# Altium project Theremin_Project.PrjPcb
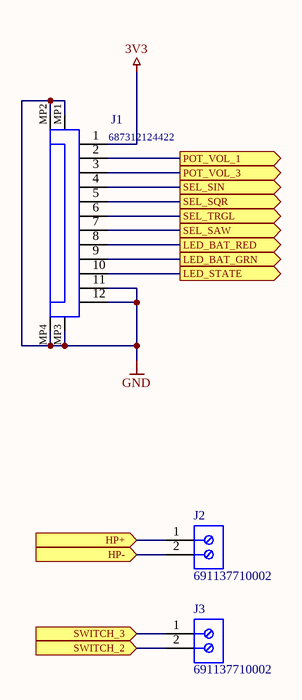
[diagram p0: Interfaces.SchDoc]
3 sheets, 55 parts. Net scope: flat (ports and power ports of the same name join across sheets).
Board file: Theremin_Chafla-Jonathan.PcbDoc
Sheets:
  Interfaces.SchDoc
  Power_Supply.SchDoc
  Central_Unit.SchDoc

## Sheet Interfaces.SchDoc
size A3; Author: M.Ricchieri; Organization: ETML-ES; Address1: Avenue Recordon 1; Address2: 1004 Lausanne; Address3: Switzerland; SheetNumber: 2; SheetTotal: 6

### Parts
J1  687312124422  [687312124422]
J2  691137710002  [691137710002]
J3  691137710002  [691137710002]

### Ports
HP+ (in), HP- (in), LED_BAT_GRN (out), LED_BAT_RED (out), LED_STATE (out), POT_VOL_1 (out), POT_VOL_3 (out), SEL_SAW (out), SEL_SIN (out), SEL_SQR (out), SEL_TRGL (out), SWITCH_2 (in), SWITCH_3 (in)

### Nets
3V3: J1.1
GND: J1.11 J1.12 J1.MP1 J1.MP2 J1.MP3 J1.MP4
RD7: J1.10 ; port LED_STATE
RE0: J1.9 ; port LED_BAT_GRN
RE1: J1.8 ; port LED_BAT_RED
Sel-Sinus: J1.4 ; port SEL_SIN
Sel-Square: J1.5 ; port SEL_SQR
Sel_Sawtooth: J1.7 ; port SEL_SAW
Sel_Triangle: J1.6 ; port SEL_TRGL
NetC21_2: J3.2 ; port SWITCH_2
NetJ1_2: J1.2 ; port POT_VOL_1
NetJ1_3: J1.3 ; port POT_VOL_3
NetJ2_1: J2.1 ; port HP+
NetJ2_2: J2.2 ; port HP-
NetJ3_1: J3.1 ; port SWITCH_3

### Notes on the sheet
- Fichier :
- a
- Date :
- Heure :
- Version :
- Auteur :
- Modif.
- b
- c
- d
- Projet :
- No :
- Nb feuilles
- Feuille n°
- Chemin :

### Library data of the parts
J1 = CMP-1502-01609-1: SMT ZIF Connectors WR-FPC, Vertical, Type A, pitch 0.5 mm, 12 pins; Manufacturer: Wurth Elektronik; Rated Current: 0.5A; Contact Design: TypeA; Withstanding Voltage: 250VAC; Contact Resistance: 20mOhm; Working Voltage: 50VAC; Pitch: 0.5mm; Pin Number: 12; Datasheet URL: https://katalog.we-online.de/em/datasheet/687312124422.pdf; Manufacturer URL: http://www.we-online.de; Publisher: WurthElektronik; Part Number: 687312124422; Operating Temperature: -25to85degC; Orientation: Vertical; Package Reference: 687312124422; Packaging: TapeandReel; Mounting Technology: SMT
J2 J3 = CMP-1502-03324-1: Series 1377 - 5.00 mm Horizontal Entry with Pressure Clamp WR-TBL, 2 pin; Manufacturer: Wurth Elektronik; Pin Number: 2; Pitch: 5.00mm; Operating Temperature: -30to120degC; Package Reference: 691137710002; Publisher: WurthElektronik; Mounting Technology: THT; Manufacturer URL: http://www.we-online.de; Packaging: Box; Part Number: 691137710002; Datasheet URL: http://katalog.we-online.de/pbs/datasheet/691137710002.pdf

## Sheet Power_Supply.SchDoc
size A3; Author: Adriano et Luis; Organization: ETML-ES; Address1: Avenue Recordon 1; Address2: 1004 Lausanne; Address3: Switzerland; Revision: 1; SheetNumber: 3; SheetTotal: 6
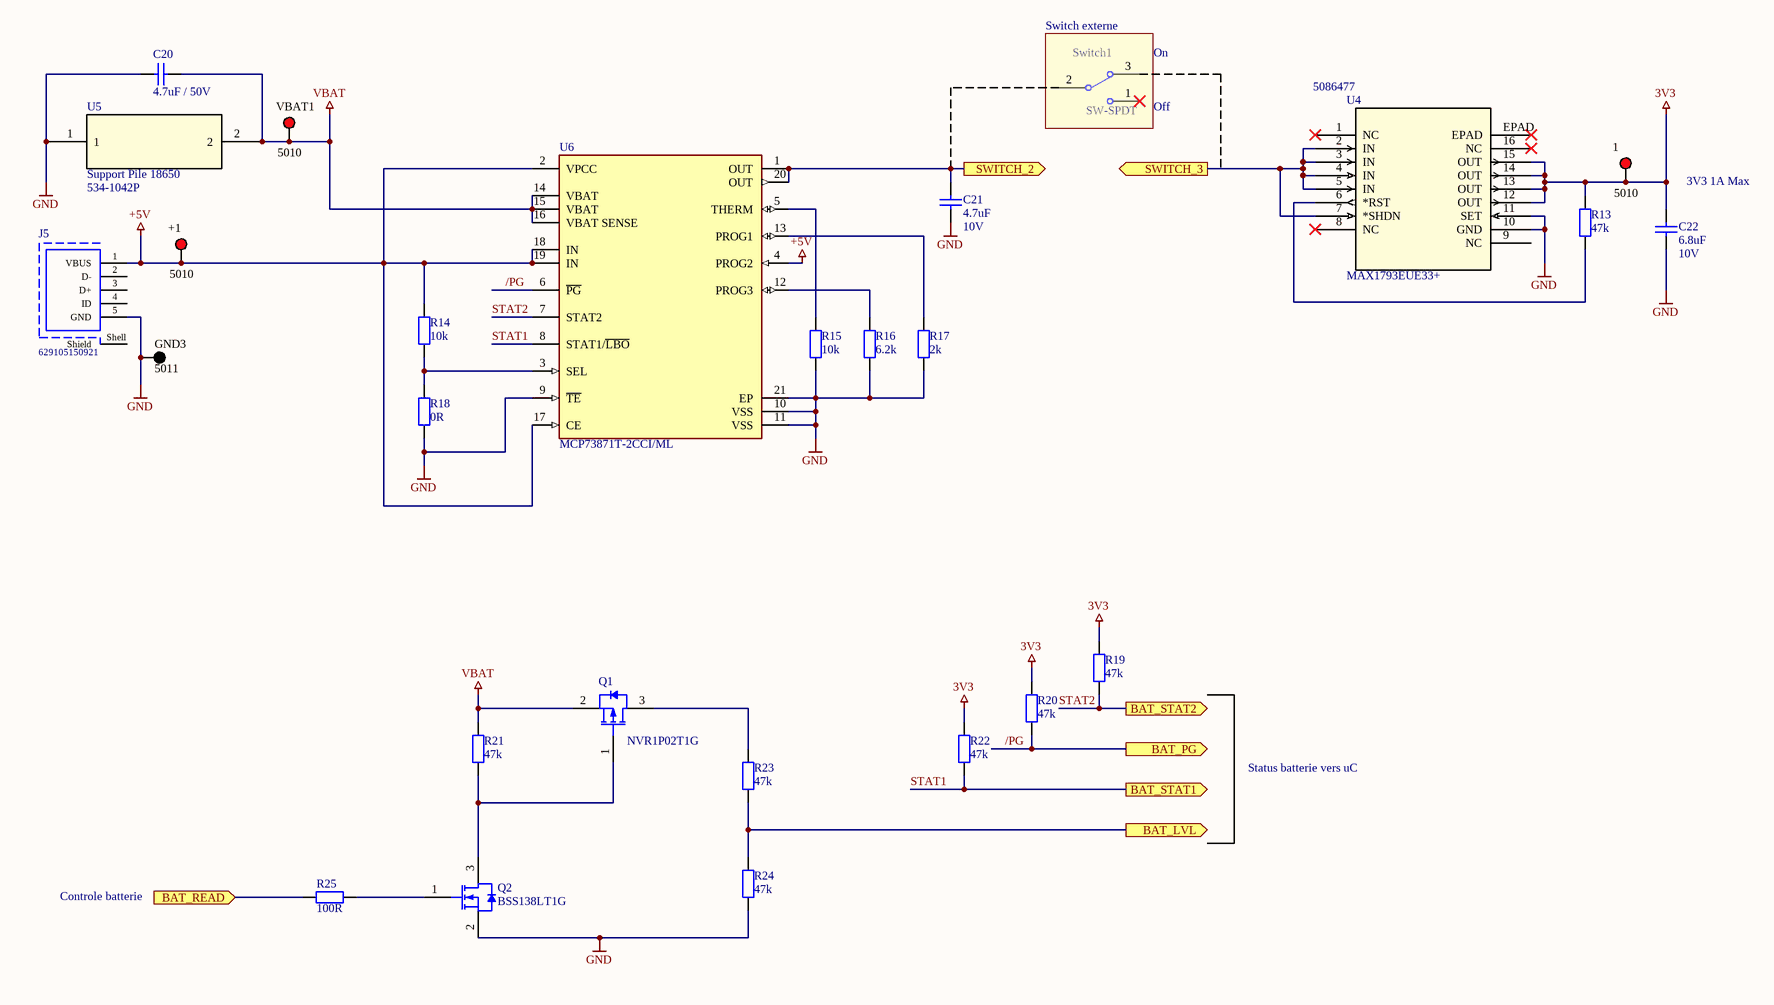
[diagram p1: Power_Supply.SchDoc]

### Parts
1  5010  [KSTN-5010_V]
+1  5010  [KSTN-5010_V]
C20  4.7uF / 50V  [CAPC0805]
C21  value 4.7uF  Tension: 10V  [CAPC0805]  (hidden comment: Cap)
C22  value 6.8uF  Tension: 10V  [CAPC0805]  (hidden comment: Cap)
GND3  5011  [KSTN-5011_V]
J5  629105150921  [629105150921]
Q1  NVR1P02T1G  [ONSC-SOT-23-3-318-08_V]
Q2  BSS138LT1G  [ONSC-SOT-23-3-318-08_V]
R13  value 47k  [RESC0805]  (hidden comment: VALUE)
R14  value 10k  [RESC0805]  (hidden comment: VALUE)
R15  value 10k  [RESC0805]  (hidden comment: VALUE)
R16  value 6.2k  [RESC0805]  (hidden comment: VALUE)
R17  value 2k  [RESC0805]  (hidden comment: VALUE)
R18  value 0R  [RESC0805]  (hidden comment: VALUE)
R19  value 47k  [RESC0805]  (hidden comment: VALUE)
R20  value 47k  [RESC0805]  (hidden comment: VALUE)
R21  value 47k  [RESC0805]  (hidden comment: VALUE)
R22  value 47k  [RESC0805]  (hidden comment: VALUE)
R23  value 47k  [RESC0805]  (hidden comment: VALUE)
R24  value 47k  [RESC0805]  (hidden comment: VALUE)
R25  value 100R  [RESC0805]  (hidden comment: VALUE)
Switch1  SW-SPDT  [TL36WW15050]  (graphical)
U4  MAX1793EUE33+  Supplier Part Number 1: 5086477  [21-0108_U16E+3_MXM]
U5  Support Pile 18650  Supplier Part Number 1: 534-1042P  [FP-1042P-MFG]
U6  MCP73871T-2CCI/ML  [FP-C04-126-IPC_C]
VBAT1  5010  [KSTN-5010_V]

### Blocks framed on the sheet
Switch externe: Switch1

### Ports
BAT_LVL (out), BAT_PG (out), BAT_READ (in), BAT_STAT1 (out), BAT_STAT2 (out), SWITCH_2 (out), SWITCH_3 (out)

### Nets
3V3: 1.1 C22.2 R13.2 R19.2 R20.2 R22.2 U4.12(OUT) U4.13(OUT) U4.14(OUT) U4.15(OUT)
+5V: +1.1 J5.1(VBUS) R14.2 U6.2(VPCC) U6.4(PROG2) U6.17(CE) U6.18(IN) U6.19(IN)
GND: C20.1 C21.1 C22.1 GND3.1 J5.5(GND) Q2.2(S) R15.1 R16.1 R17.1 R18.1 R24.1 U4.10(GND) U4.11(SET) U5.1 U6.9(~{TE}) U6.10(VSS) U6.11(VSS) U6.21(EP)
VBAT: C20.2 Q1.2(S) R21.1 U5.2 U6.14(VBAT) U6.15(VBAT) U6.16(VBAT_SENSE) VBAT1.1
/PG: R20.1 U6.6(~{PG}) ; port BAT_PG
ADC-Battery: R23.1 R24.2 ; port BAT_LVL
RC6: R25.1 ; port BAT_READ
STAT1: R22.1 U6.8(STAT1/~{LBO}) ; port BAT_STAT1  [project net RD6]
STAT2: R19.1 U6.7(STAT2) ; port BAT_STAT2  [project net RD5]
NetC21_2: C21.2 U6.1(OUT) U6.20(OUT) ; port SWITCH_2
NetJ3_1: U4.2(IN) U4.3(IN) U4.4(IN) U4.5(IN) U4.7(*SHDN) ; port SWITCH_3
NetQ1_1: Q1.1(G) Q2.3(D) R21.2
NetQ1_3: Q1.3(D) R23.2
NetQ2_1: Q2.1(G) R25.2
NetR13_1: R13.1 U4.6(*RST)
NetR14_1: R14.1 R18.2 U6.3(SEL)
NetR15_2: R15.2 U6.5(THERM)
NetR16_2: R16.2 U6.12(PROG3)
NetR17_2: R17.2 U6.13(PROG1)

Not connected (* = marked no-connect by the designer): J5 2(D-) 3(D+) 4(ID) Shell(Shield); Switch1 1* 2 3; U4 1(NC)* 8(NC)* 9(NC) 16(NC)* EPAD*

### Notes on the sheet
- (near Switch1) Off
- (near Switch1) On
- 3V3 1A Max
- Status batterie vers uC
- Controle batterie
- Fichier :
- a
- Date :
- Heure :
- Version :
- Auteur :
- Modif.
- b
- c
- d
- Projet :
- No :
- Nb feuilles
- Feuille n°
- Chemin :

### Library data of the parts
1 +1 VBAT1 = CMP-1672-00002-4: Test Point, Red, Through Hole, RoHS, Bulk; Manufacturer: Keystone; Contact Material: Bronze; Mounting Technology: Through Hole; RoHSCompliant: true; Pins: 1; Package Quantity: 100; ComponentLink2Description: Datasheet; Height: 8.12 mm; ComponentLink1URL: http://www.keyelco.com/; DatasheetVersion: Rev. F, 12/2013; Mount: Through Hole; PackageReference: 5010; Contact Plating: Silver; Packaging: Bulk; Colour: Red; REACH SVHC: No SVHC; PackageDescription: 1-Pin Through Hole Device, Dia 3.17 mm; ComponentLink2URL: http://www.keyelco.com/product-pdf.cfm?p=1319; ComponentLink1Description: Manufacturer URL
C20-C22 = Cap: Capacitor; Published: 8-Jun-2000; LatestRevisionDate: 17-Jul-2002; LatestRevisionNote: Re-released for DXP Platform.; PackageReference: RAD-0.3; Publisher: Altium Limited; PackageDescription: Radial Cap, Thru-Hole; 2 Leads; 0.3 in Pin Spacing
GND3 = CMP-1672-00003-4: Test Point, Black, Through Hole, RoHS, Bulk; Manufacturer: Keystone; ComponentLink2URL: http://www.keyelco.com/product-pdf.cfm?p=1320; Colour: Black; Pins: 1; REACH SVHC: No SVHC; ComponentLink1URL: http://www.keyelco.com/; PackageReference: 5011; Contact Plating: Silver; Package Quantity: 100; Packaging: Bulk; RoHSCompliant: true; Height: 8.12 mm; PackageDescription: 1-Pin Through Hole Device, Dia 3.17 mm; Mount: Through Hole; Mounting Technology: Through Hole; DatasheetVersion: Rev. F, 12/2013; ComponentLink1Description: Manufacturer URL; Contact Material: Bronze; ComponentLink2Description: Datasheet
J5 = CMP-1502-03249-1: Micro USB 2.0 Type AB Receptacle WR-COM, Horizontal, SMT; Manufacturer: Wurth Elektronik; Rated Current: 1.8A; Contact Resistance: 30mOhm; Working Voltage: 30VAC; Publisher: WurthElektronik; Part Number: 629105150921; Operating Temperature: -40to85degC; Gender: Receptacle; Packaging: TapeandReel; Connector Type: MicroUSB2.0TypeAB; Datasheet URL: https://katalog.we-online.de/em/datasheet/629105150921.pdf; Mounting Technology: SMT; Orientation: Horizontal; Package Reference: 629105150921; Manufacturer URL: http://www.we-online.de
Q1 = CMP-1058-00745-1: Power MOSFET, -20 V, -1 A, P-Channel, 3-Pin SOT-23, Pb-Free, Tape and Reel; Manufacturer: On Semiconductor; Ciss Typ (pF): 165; Configuration: Single; VGS(th) Max (V): 2.3; Channel Polarity: P Channel; V(BR)DSS Min (V): 20; ID Max (A): 1; Coss Typ (pF): 110; Qrr Typ (nC): 8; Crss Typ (pF): 35; PD Max (W): 0.4; DatasheetVersion: Rev. 7; ComponentLink1Description: Manufacturer URL; PackageReference: SOT-23-3-318-08; ComponentLink2Description: Datasheet; ComponentLink2URL: http://www.onsemi.cn/pub_link/Collateral/NTR1P02T1-D.PDF; Packing: Tape and Reel; Package Type: SOT-23-3; ComponentLink1URL: http://www.onsemi.com/; RoHS: Pb-Free; PartNumber: NVR1P02T1G; PackageVersion: Rev. AP, 11/2009; PackageDescription: 3-Pin Small Outline Transistor, Body 2.92 x 1.3 mm, Pitch 0.95 mm; ComponentLink3URL: http://www.onsemi.cn/pub_link/Collateral/318-08.PDF; ComponentLink3Description: Package Specification; VGS Max (V): 20; Mounting Technology: Surface Mount
Q2 = CMP-1058-00767-1: Power MOSFET, 200 mA, 50 V, N-Channel, 3-Pin SOT-23, Pb-Free, Tape and Reel; Manufacturer: On Semiconductor; PD Max (W): 0.225; Coss Typ (pF): 12; V(BR)DSS Min (V): 50; VGS Max (V): 20; Channel Polarity: N Channel; Configuration: Single; VGS(th) Max (V): 1.5; Ciss Typ (pF): 40; Crss Typ (pF): 3.5; ID Max (A): 0.2; ComponentLink3Description: Package Specification; PackageDescription: 3-Pin Small Outline Transistor, Body 2.92 x 1.3 mm, Pitch 0.95 mm; PackageReference: SOT-23-3-318-08; RoHS: Pb-Free; Mounting Technology: Surface Mount; ComponentLink1Description: Manufacturer URL; ComponentLink2URL: http://www.onsemi.com/pub_link/Collateral/BSS138LT1-D.PDF; ComponentLink2Description: Datasheet; Packing: Tape and Reel; PackageVersion: Rev. AP, 11/2009; PartNumber: BSS138LT1G; Package Type: SOT-23-3; ComponentLink1URL: http://www.onsemi.com/; DatasheetVersion: Rev. 8; ComponentLink3URL: http://www.onsemi.cn/pub_link/Collateral/318-08.PDF
R13-R25 = RES: Resistor
Switch1 = SW-SPDT: SPDT Subminiature Toggle Switch, Right Angle Mounting, Vertical Actuation; Published: 24-Mar-1999; LatestRevisionDate: 17-Dec-2003; LatestRevisionNote: Schematic revised, PCB Footprint replaced.; DatasheetVersion: 05-Dec-2000; PackageReference: TL36WW15050; Publisher: Altium Limited; PackageDescription: Switch; 4 Leads; ComponentLink1Description: Manufacturer Link; ComponentLink1URL: http://www.apem.com
U4 = MAX1793EUE33+: Fixed/Adjustable Positive LDO Regulator, 1.25V Min, 5V Max, 0.35V Dropout, PMOS, PDSO16; Mfr_Name: Maxim Integrated Products; Manufacturer 1: Maxim; Package Body Material: Plastic; Regulator Type: FIXED/ADJUSTABLE POSITIVE SINGLE OUTPUT LDO REGULATOR; Dropout Voltage1-Max: 350mV; Dropout Voltage1-Nom: 210mV; Input Voltage Absolute-Max: 6V; Line Regulation-Max: 0.0104%; Line Regulation-Max (%/V): 0.015; Number of Functions: 1; Output Current1-Max: 1A; Output Voltage1-Nom: 3.3V; Package Equivalence Code: TSSOP16,.25; Time @ Peak Reflow Temperature-Max (s): 30s; Voltage Tolerance-Max: 3%; Qualification Status: Not Qualified; Copyright: Copyright (C) 2021 Ultra Librarian. All rights reserved.; Manufacturer_Part_Number: MAX1793EUE33+; Digi-Key_Part_Number_1: MAX1793EUE33+-ND; RefDes: RefDes; Type: DEV; Supplier 1: Future Electronics; Manufacturer Part Number 1: MAX1793EUE33+; RoHS: Yes; Category: Voltage Regulators - Linear; Stock 1: 11; Pricing 1: 1=2,68000, 20=2,37000, 40=2,31000, 125=2,20000, 250=2,14000 (USD); Package Code: HTSSOP; Number of Pins: 16; Package Shape: Rectangular; Terminal Finish: Tin; Min Operating Temperature: 0°C; Max Operating Temperature: 85°C; Moisture Sensitivity Level: 1; JESD-609 Code: e3; Adjustability: FIXED/ADJUSTABLE; JESD-30 Code: R-PDSO-G16; Number of Outputs: 1; Operating Temperature, TJ-Max: 150°C; Output Voltage1-Max: 5V; Output Voltage1-Min: 1.25V; Package Style: SMALL OUTLINE, HEAT SINK/SLUG, THIN PROFILE, SHRINK PITCHMeter; Peak Reflow Temperature (Cel): 260°C; Surface Mount: Yes; Technology: PMOS; Terminal Form: Gull Wing; Terminal Position: DUAL; Length: 5mm; Width: 4.4mm; Height - Seated (Max): 1.1mm; Terminal Pitch: 0.65mm; REACH SVHC: Yes; RoHS Compliant: Yes; ComponentLink1URL: https://datasheet.ciiva.com:443/pdfs/VipMasterIC/IC/MAXM/MAXMS12433/MAXMS12433-1.pdf?src-supplier=IHS+Markit; ComponentLink1Description: https://datasheet.ciiva.com:443/pdfs/VipMasterIC/IC/MAXM/MAXMS12433/MAXMS12433-1.pdf?src-supplier=IHS+Markit; ComponentLink2URL: https://datasheet.ciiva.com/2051/max1793-2051488.pdf?src-supplier=Digi-Key; ComponentLink2Description: https://datasheet.ciiva.com/2051/max1793-2051488.pdf?src-supplier=Digi-Key; ComponentLink3URL: https://datasheet.ciiva.com/26903/max1793eue33-26903273.pdf?src-supplier=IIIC; ComponentLink3Description: https://datasheet.ciiva.com/26903/max1793eue33-26903273.pdf?src-supplier=IIIC; ComponentLink4URL: https://datasheet.ciiva.com/4887/max1793-45937-4887771.pdf?src-supplier=Mouser; ComponentLink4Description: https://datasheet.ciiva.com/4887/max1793-45937-4887771.pdf?src-supplier=Mouser; ComponentLink5URL: https://datasheet.ciiva.com/14282/max1793-14282095.pdf?src-supplier=Avnet; ComponentLink5Description: https://datasheet.ciiva.com/14282/max1793-14282095.pdf?src-supplier=Avnet
U5 = 1042P: No Description Available; Supplier 1: Mouser
U6 = CMP-06318-000014-1: IC USB/AC BATT CHRGR W/PPM 20QFN; Min Supply Voltage: 4.5V; Output Current: 1A; Output Voltage: 4.2V; Max Supply Voltage: 6V; Case/Package: QFN; RoHS Compliant: Yes; Min Operating Temperature: -40°C; Mount: Surface Mount; Package Quantity: 3300; Packaging: Tape and Reel; Number of Pins: 20; Max Operating Temperature: 85°C; Lead Free: Lead Free; Contact Plating: Tin

## Sheet Central_Unit.SchDoc
size A3; Organization: ETML-ES; Address1: Avenue Recordon 1; Address2: 1004 Lausanne; Address3: Switzerland; SheetNumber: 6; SheetTotal: 6
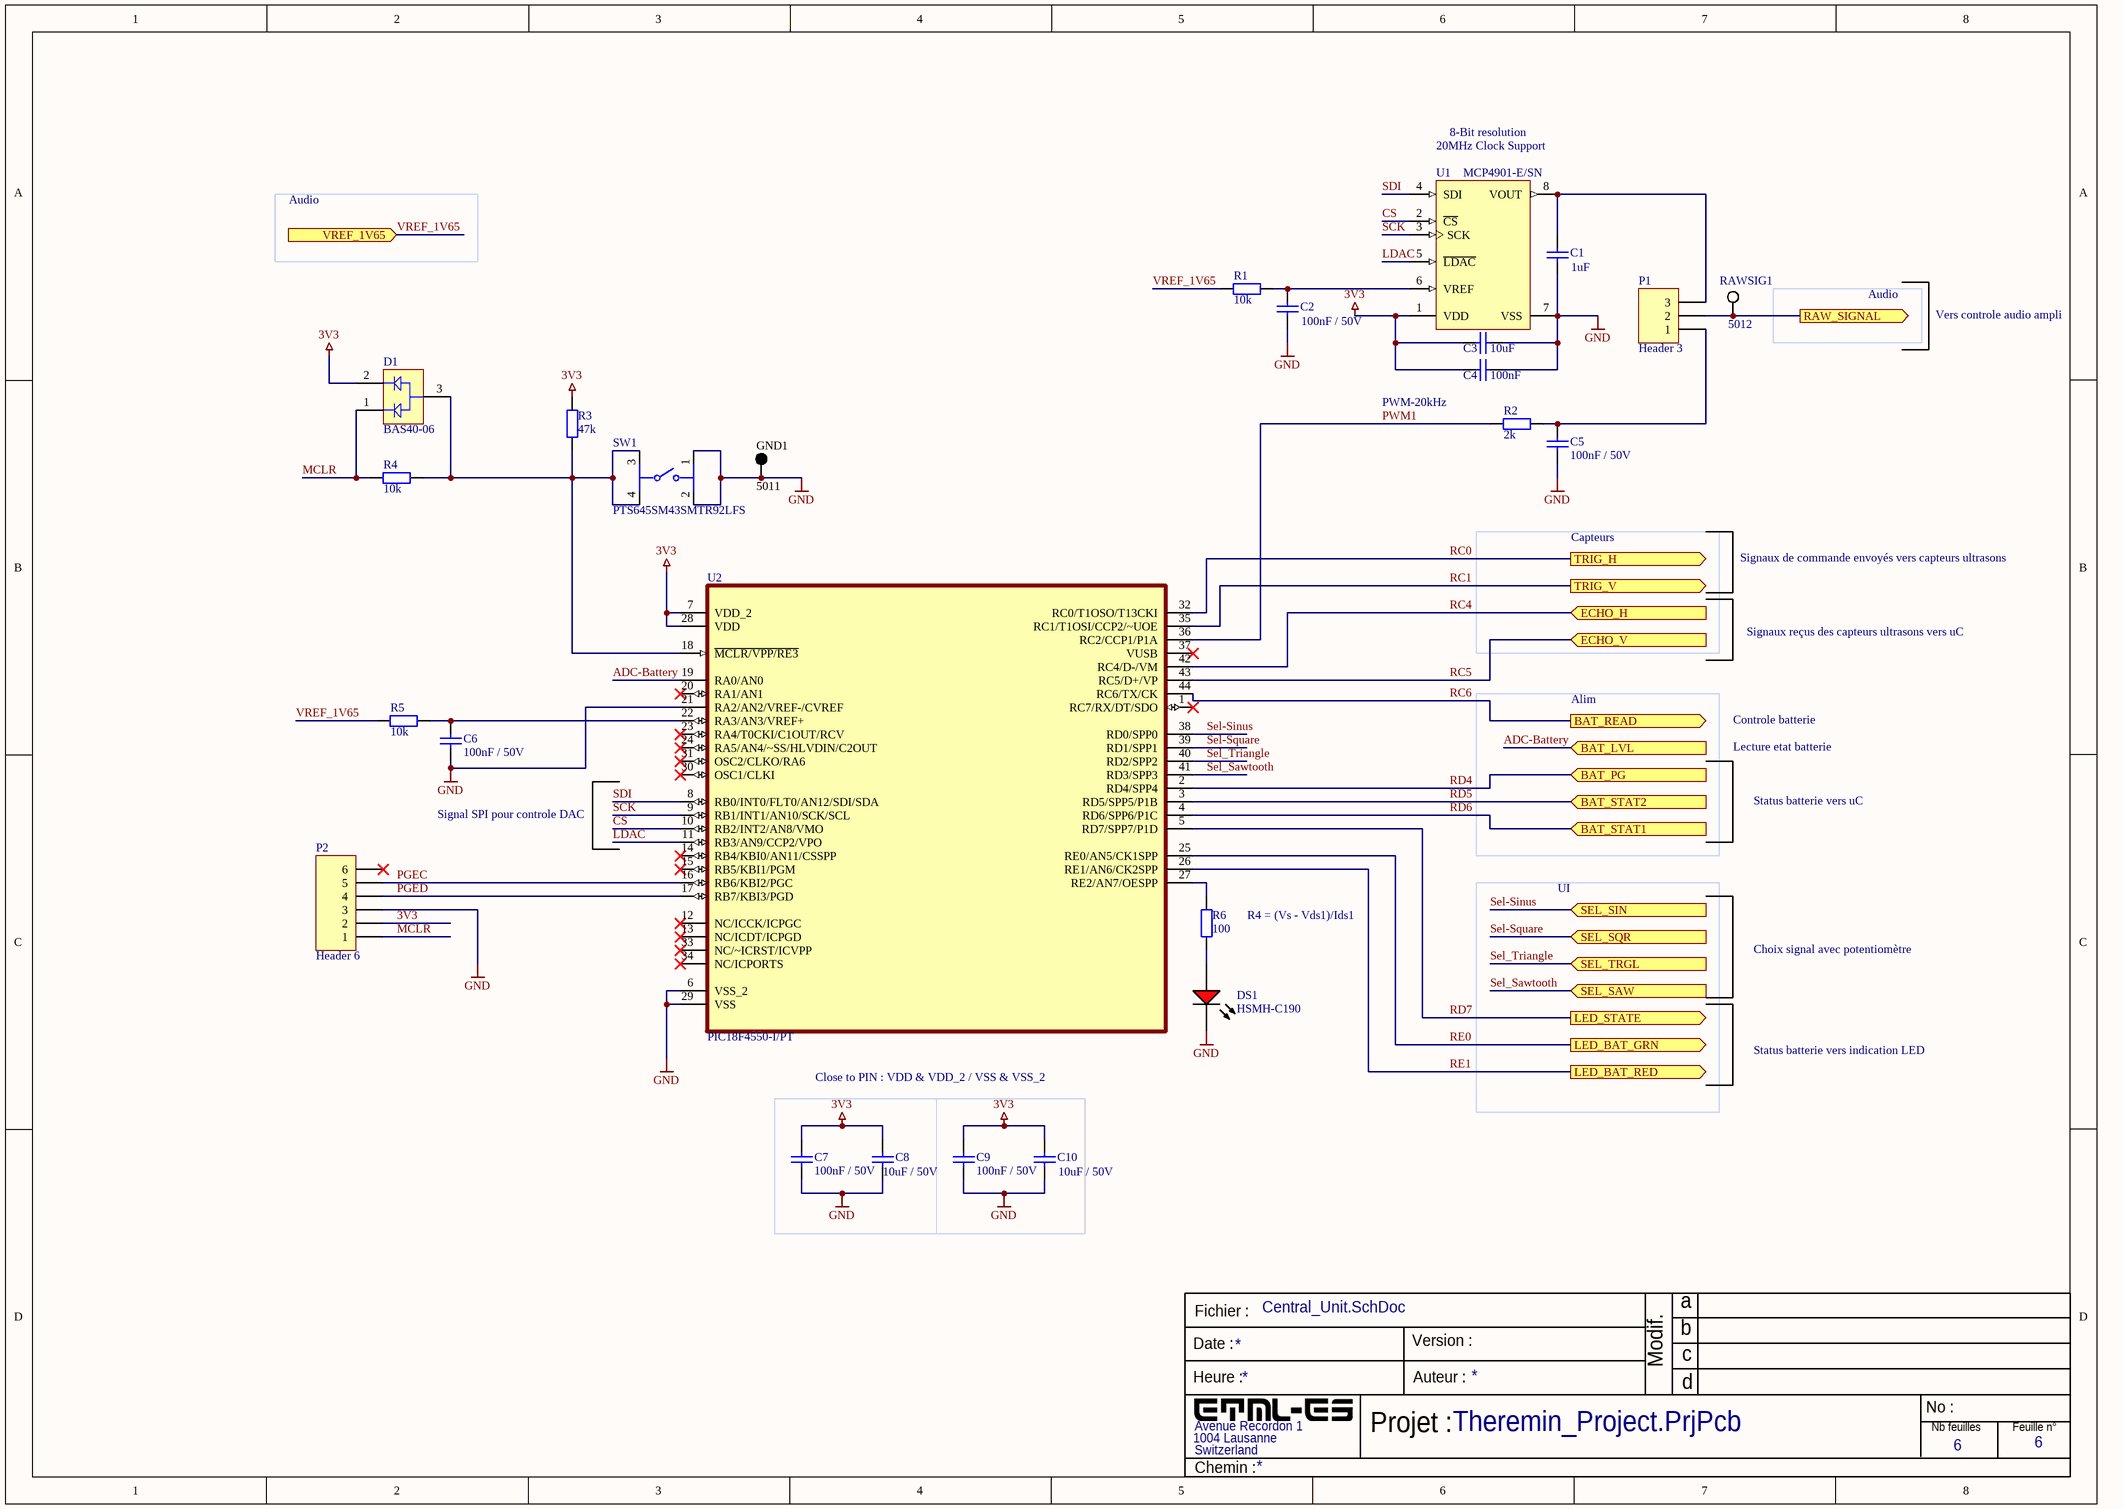
[diagram p2: Central_Unit.SchDoc]

### Parts
C1  1uF  [CAPC0805]
C2  100nF / 50V  [CAPC0805]
C3  10uF  [CAPC0805]
C4  100nF  [CAPC0805]
C5  100nF / 50V  [CAPC0805]
C6  100nF / 50V  [CAPC0805]
C7  100nF / 50V  [CAPC0805]
C8  10uF / 50V  [CAPC0805]
C9  100nF / 50V  [CAPC0805]
C10  10uF / 50V  [CAPC0805]
D1  BAS40-06  [INF-SOT23_M]
DS1  HSMH-C190  [AVAG-HSMX-C190_V]
GND1  5011  [KSTN-5011_V]
P1  Header 3  [PIN-1x03_2.54]
P2  Header 6  [PIN-1x06_2.54]
R1  10k  [RESC0805]
R2  2k  [RESC0805]
R3  47k  [RESC0805]
R4  10k  [RESC0805]
R5  10k  [RESC0805]
R6  100  [RESC0805]
RAWSIG1  5012  [KSTN-5012_V]
SW1  PTS645SM43SMTR92LFS  [FP-PTS645SM43SMTR92LFS-MFG]
U1  MCP4901-E/SN  [SOIC-SN8_N]
U2  PIC18F4550-I/PT  [TQFP80P1200X1200X120-44M]

### Blocks framed on the sheet
Close to PIN : VDD & VDD_2 / VSS & VSS_2: C7 C8

### Ports
BAT_LVL (in), BAT_PG (in), BAT_READ (out), BAT_STAT1 (in), BAT_STAT2 (in), ECHO_H (in), ECHO_V (in), LED_BAT_GRN (out), LED_BAT_RED (out), LED_STATE (out), RAW_SIGNAL (out), SEL_SAW (in), SEL_SIN (in), SEL_SQR (in), SEL_TRGL (in), TRIG_H (out), TRIG_V (out), VREF_1V65 (in)

### Nets
3V3: C3.1 C4.1 C7.1 C8.1 C9.1 C10.1 D1.2(K2) P2.2 R3.1 U1.1(VDD) U2.7(VDD_2) U2.28(VDD)
GND: C1.2 C2.2 C3.2 C4.2 C5.2 C6.2 C7.2 C8.2 C9.2 C10.2 DS1.2(K) GND1.1 P2.3 SW1.1 SW1.2 U1.7(VSS) U2.6(VSS_2) U2.21(RA2/AN2/VREF-/CVREF) U2.29(VSS)
ADC-Battery: U2.19(RA0/AN0) ; port BAT_LVL
CS: U1.2(~{CS}) U2.10(RB2/INT2/AN8/VMO)
LDAC: U1.5(~{LDAC}) U2.11(RB3/AN9/CCP2/VPO)
MCLR: D1.1(K1) P2.1 R4.2
PGEC: P2.5 U2.16(RB6/KBI2/PGC)
PGED: P2.4 U2.17(RB7/KBI3/PGD)
PWM1: R2.2 U2.36(RC2/CCP1/P1A)
RC0: U2.32(RC0/T1OSO/T13CKI) ; port TRIG_H
RC1: U2.35(RC1/T1OSI/CCP2/~UOE) ; port TRIG_V
RC4: U2.42(RC4/D-/VM) ; port ECHO_H
RC5: U2.43(RC5/D+/VP) ; port ECHO_V
RC6: U2.44(RC6/TX/CK) ; port BAT_READ
RD4: U2.2(RD4/SPP4) ; port BAT_PG  [project net /PG]
RD5: U2.3(RD5/SPP5/P1B) ; port BAT_STAT2
RD6: U2.4(RD6/SPP6/P1C) ; port BAT_STAT1
RD7: U2.5(RD7/SPP7/P1D) ; port LED_STATE
RE0: U2.25(RE0/AN5/CK1SPP) ; port LED_BAT_GRN
RE1: U2.26(RE1/AN6/CK2SPP) ; port LED_BAT_RED
SCK: U1.3(SCK) U2.9(RB1/INT1/AN10/SCK/SCL)
SDI: U1.4(SDI) U2.8(RB0/INT0/FLT0/AN12/SDI/SDA)
Sel-Sinus: U2.38(RD0/SPP0) ; port SEL_SIN
Sel-Square: U2.39(RD1/SPP1) ; port SEL_SQR
Sel_Sawtooth: U2.41(RD3/SPP3) ; port SEL_SAW
Sel_Triangle: U2.40(RD2/SPP2) ; port SEL_TRGL
VREF_1V65: R1.2 R5.2 ; port VREF_1V65
NetC1_1: C1.1 P1.3 U1.8(VOUT)
NetC2_1: C2.1 R1.1 U1.6(VREF)
NetC5_1: C5.1 P1.1 R2.1
NetC6_1: C6.1 R5.1 U2.22(RA3/AN3/VREF+)
NetD1_3: D1.3(A) R3.2 R4.1 SW1.3 SW1.4 U2.18(~{MCLR/VPP/RE3})
NetDS1_1: DS1.1(A) R6.2
NetP1_2: P1.2 RAWSIG1.1 ; port RAW_SIGNAL
NetR6_1: R6.1 U2.27(RE2/AN7/OESPP)

Not connected (* = marked no-connect by the designer): P2 6*; U2 1(RC7/RX/DT/SDO)* 12(NC/ICCK/ICPGC)* 13(NC/ICDT/ICPGD)* 14(RB4/KBI0/AN11/CSSPP)* 15(RB5/KBI1/PGM)* 20(RA1/AN1)* 23(RA4/T0CKI/C1OUT/RCV)* 24(RA5/AN4/~SS/HLVDIN/C2OUT)* 30(OSC1/CLKI)* 31(OSC2/CLKO/RA6)* 33(NC/~ICRST/ICVPP)* 34(NC/ICPORTS)* 37(VUSB)*

### Notes on the sheet
- (near U1) 20MHz Clock Support
- 8-Bit resolution
- Audio
- Vers controle audio ampli
- PWM-20kHz
- Capteurs
- Signaux de commande envoyés vers capteurs ultrasons
- Signaux reçus des capteurs ultrasons vers uC
- Alim
- Controle batterie
- Lecture etat batterie
- Signal SPI pour controle DAC
- Status batterie vers uC
- (near R6) R4 = (Vs - Vds1)/Ids1
- UI
- Choix signal avec potentiomètre
- Status batterie vers indication LED
- Fichier :
- a
- Date :
- Heure :
- Version :
- Auteur :
- Modif.
- b
- c
- d
- Projet :
- No :
- Nb feuilles
- Feuille n°
- Chemin :

### Library data of the parts
C1-C10 = Cap: Capacitor; Published: 8-Jun-2000; LatestRevisionDate: 17-Jul-2002; LatestRevisionNote: Re-released for DXP Platform.; PackageReference: RAD-0.3; Publisher: Altium Limited; PackageDescription: Radial Cap, Thru-Hole; 2 Leads; 0.3 in Pin Spacing
D1 = CMP-1182-00022-1: Silicon Schottky Diode, -55 to 150 degC, SOT23, Reel, Green; Manufacturer: Infineon; Configuration: Dual; VR (max): 40Â V; IF (max): 120Â mA; Green: TRUE; VF (max): 1,000Â mV; CT (max): 5Â pF; ComponentLink2Description: Datasheet; Packing: Reel; PackageVersion: Apr-08; PartNumber: BAS40-06; ComponentLink2URL: http://www.infineon.com/dgdl/bas40_bas140series.pdf?folderId=db3a30431400ef68011425f1ca2505e3&fileId=db3a304314dca389011518a57ed20e11; PackageReference: SOT23; Mounting Technology: Surface Mount; ComponentLink3Description: Package Specification; PackageDescription: 3-Pin Small Outline Transistor Package, 1.3 x 2.9 mm Body, 0.95 mm Pitch; ComponentLink1URL: http://www.infineon.com/; ComponentLink3URL: http://www.infineon.com/dgdl/SOT23-Package_Overview.pdf?folderId=db3a30431936bc4b0119532290053c66&fileId=db3a30431936bc4b0119533468123c85; ComponentLink1Description: Manufacturer URL
DS1 = CMP-1744-00004-1: LED Uni-Color Red, 65 mW, 20 mA, -40 to 85 degC, 2-Pin SMD, RoHS, Tape and Reel; Connector Type: USB; Gender: Male; Current Rating: 1 A; Length: 7.5 mm; Lead Pitch: 0.65 mm; PackageReference: HSMX-C190; Package Quantity: 2000; Max Operating Temperature: 85 degC; PackageDescription: 2-Pin Surface Mount Device, Body 1.6 x 0.8 mm, Height 0.9 mm; ComponentLink3Description: Package Specification; Mount: Surface Mount; Min Operating Temperature: -30 degC; ComponentLink3URL: http://www.fairchildsemi.com/dwg/MA/MA03D.pdf; ComponentLink1Description: Manufacturer URL; Contact Material: Copper; Pins: 5; Width: 5.6 mm; ComponentLink2Description: Datasheet; RoHSCompliant: true; DatasheetVersion: Mar-12; Height: 2.8 mm; Packaging: Tape and Reel; Contact Plating: Gold; ComponentLink1URL: http://www.avagotech.com/; REACH SVHC: No SVHC; ComponentLink2URL: http://docs.avagotech.com/docs/AV02-0551EN
GND1 = CMP-1672-00003-4: as GND3 on sheet Power_Supply; ComponentLink2URL: http://www.keyelco.com/product-pdf.cfm?p=1320; Colour: Black; Pins: 1; REACH SVHC: No SVHC; ComponentLink1URL: http://www.keyelco.com/; PackageReference: 5011; Contact Plating: Silver; Package Quantity: 100; Packaging: Bulk; RoHSCompliant: true; Height: 8.12 mm; PackageDescription: 1-Pin Through Hole Device, Dia 3.17 mm; Mount: Through Hole; Mounting Technology: Through Hole; DatasheetVersion: Rev. F, 12/2013; ComponentLink1Description: Manufacturer URL; Contact Material: Bronze; ComponentLink2Description: Datasheet
P1 = Header 3: Header, 3-Pin; LatestRevisionDate: 17-Jul-2002; LatestRevisionNote: Re-released for DXP Platform.; Publisher: Altium Limited
P2 = Header 6: Header, 6-Pin; LatestRevisionDate: 17-Jul-2002; LatestRevisionNote: Re-released for DXP Platform.; Publisher: Altium Limited
R1-R6 = RES: Resistor
RAWSIG1 = CMP-1672-00004-4: Test Point, White, Through Hole, RoHS, Bulk; Manufacturer: Keystone; DatasheetVersion: Rev. F, 12/2013; ComponentLink1URL: http://www.keyelco.com/; PackageReference: 5012; RoHSCompliant: true; ComponentLink2Description: Datasheet; Colour: White; Contact Material: Bronze; PackageDescription: 1-Pin Through Hole Device, Dia 3.17 mm; Mounting Technology: Through Hole; Mount: Through Hole; Package Quantity: 100; ComponentLink1Description: Manufacturer URL; Pins: 1; Height: 8.12 mm; Packaging: Bulk; REACH SVHC: No SVHC; Contact Plating: Silver; Length: 11.3 mm; ComponentLink2URL: http://www.keyelco.com/product-pdf.cfm?p=1321
SW1 = CMP-2000-05160-2: SWITCH TACTILE SPST-NO 0.05A 12V; Contact Resistance: 100mR; Throw Configuration: SPST; Illumination Type: Non-Illuminated; Mechanical Life: 100000Cycles; Current Rating: 50mA; Switch Function: Off-Mom; Actuator Length: 0.85mm; Actuator Material: Nylon; Actuator Type: Standard; Operating Force: 160gf; Min Operating Temperature: -20°C; REACH SVHC: No SVHC; Termination: Gull Wing; Case/Package: SMD/SMT; Packaging: Tape and Reel; Mount: Surface Mount; Voltage Rating (DC): 12V; Orientation: Straight; Lead Free: Lead Free; Contact Material: Silver; Color: Black; Max Current Rating: 50mA; Contact Plating: Silver; Depth: 9mm; Package Quantity: 1; Max Voltage Rating (DC): 12V; Length: 6mm; Max Operating Temperature: 60°C
U1 = CMP-0188-01155-1: 8-Bit DAC with SPI Interface, 8-Pin SOIC 150mil, Extended Temperature; ComponentLink1URL: http://www.microchip.com/; Code_JEDEC: MS-012; ComponentLink2Description: Datasheet; PackageDescription: 8-Lead Plastic Small Outline (SN) - Narrow, 3.90mm Body [SOIC]; ComponentLink3URL: http://www.microchip.com/stellent/groups/techpub_sg/documents/packagingspec/en012702.pdf; ComponentLink3Description: Package Specification; PackageVersion: revBB, Aug-2009; ComponentLink1Description: Manufacturer URL; Code_IPC: SOIC127P600-8; PackageReference: SOIC-SN8; ComponentLink2URL: http://ww1.microchip.com/downloads/en/DeviceDoc/22248a.pdf; DatasheetVersion: revA, Apr-2010
U2 = PIC18F4550-I/PT: PIC PICÂ® 18F Microcontroller IC 8-Bit 48MHz 32KB _16K x 16_ FLASH 44-TQFP _10x10_; MF: Microchip; MP: PIC18F4550-I/PT; Package: TQFP-44 Microchip; Price: None; Value: *; SnapEDA_Link: https://www.snapeda.com/parts/PIC18F4550-I/PT/Microchip/view-part/4713/?ref=snap; Availability: Unavailable

## Nets that join several sheets
3V3: Interfaces (J1.1), Power_Supply (10 pins), Central_Unit (12 pins)
GND: Interfaces (6 pins), Power_Supply (18 pins), Central_Unit (19 pins)
/PG: Power_Supply (R20.1 U6.6), Central_Unit (U2.2)
ADC-Battery: Power_Supply (R23.1 R24.2), Central_Unit (U2.19)
NetC21_2: Interfaces (J3.2), Power_Supply (C21.2 U6.1 U6.20)
NetJ3_1: Interfaces (J3.1), Power_Supply (5 pins)
RC6: Power_Supply (R25.1), Central_Unit (U2.44)
RD5: Power_Supply (R19.1 U6.7), Central_Unit (U2.3)
RD6: Power_Supply (R22.1 U6.8), Central_Unit (U2.4)
RD7: Interfaces (J1.10), Central_Unit (U2.5)
RE0: Interfaces (J1.9), Central_Unit (U2.25)
RE1: Interfaces (J1.8), Central_Unit (U2.26)
Sel-Sinus: Interfaces (J1.4), Central_Unit (U2.38)
Sel-Square: Interfaces (J1.5), Central_Unit (U2.39)
Sel_Sawtooth: Interfaces (J1.7), Central_Unit (U2.41)
Sel_Triangle: Interfaces (J1.6), Central_Unit (U2.40)